# Altium schematic sheet Power.SchDoc
size A4; DocumentNumber: 2; SheetNumber: 2; SheetTotal: 8
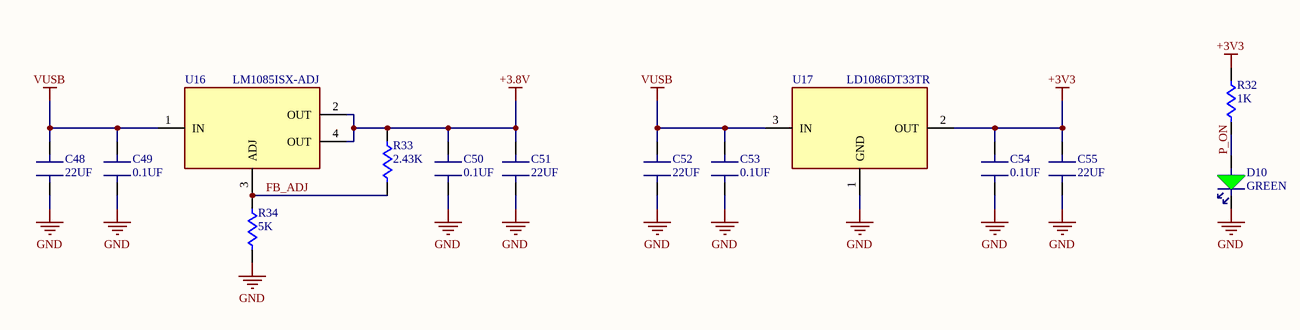
[diagram p0: Power.SchDoc]

## Parts
C48  22UF  [CAP: 1206]
C49  0.1UF  [CAP: 0603]
C50  0.1UF  [CAP: 0603]
C51  22UF  [CAP: 1206]
C52  22UF  [CAP: 1206]
C53  0.1UF  [CAP: 0603]
C54  0.1UF  [CAP: 0603]
C55  22UF  [CAP: 1206]
D10  GREEN  [LED: 0603G]
R32  1K  [RES: 0603]
R33  2.43K  [RES: 0603]
R34  5K  [RES: 0603]
U16  LM1085ISX-ADJ  [TO263-3]
U17  LD1086DT33TR  [DPAK]

## Nets
+3.8V: C50.1(A) C51.2(B) R33.2 U16.2(OUT) U16.4(OUT)
+3V3: C54.1(A) C55.2(B) R32.2 U17.2(OUT)
GND: C48.1(A) C49.2(B) C50.2(B) C51.1(A) C52.1(A) C53.2(B) C54.2(B) C55.1(A) D10.1(C) R34.2 U17.1(GND)
VUSB: C48.2(B) C49.1(A) C52.2(B) C53.1(A) U16.1(IN) U17.3(IN)
FB_ADJ: R33.1 R34.1 U16.3(ADJ)
P_ON: D10.2(A) R32.1

## Notes on the sheet
- Size:
- Date:
- Sheet Name:
- A4
- Sheet
- Time:
- of
- Author :
- Hatim Saad
- Project:
- File:

## Library data of the parts
C48 C51 C52 C55 = CAP 1206: CAP SMD 1206
C49 C50 C53 C54 = CAP 0603: CAP SMD 0603
D10 = LED GREEN 0603: LED GREEN CLEAR 0603 SMD
R32-R34 = RES 0603: RES SMD 0603
U16 = LM1085ISX-ADJ/NOPB: 3-A, 29-V, linear voltage regulator 3-DDPAK/TO-263 -40 to 125; Manufacturer: TI National Semiconductor; Supplier: Mouser; Supplier Part Number: 926-LM1085ISXADJNOPB; Manufacturer Part Number: LM1085ISX-ADJ/NOPB; RoHS: Yes; Category: Voltage Regulators - Linear; Stock: 9505; Pricing: 1=2.08, 10=1.83, 50=1.83, 100=1.47, 1000=1.02, 10000=0.896 (USD); ComponentLink1URL: https://datasheet.ciiva.com/6582/lm1085-6582736.pdf?src-supplier=Digi-Key; ComponentLink1Description: https://datasheet.ciiva.com/6582/lm1085-6582736.pdf?src-supplier=Digi-Key; ComponentLink2URL: https://datasheet.ciiva.com/41457/001013601-da-01-en-ic-reg-l-lm1085isx-adj-nopb-to-263-3-tid-41457358.pdf?src-supplier=Conrad; ComponentLink2Description: https://datasheet.ciiva.com/41457/001013601-da-01-en-ic-reg-l-lm1085isx-adj-nopb-to-263-3-tid-41457358.pdf?src-supplier=Conrad; Supplier 1: Mouser; Supplier Part Number 1: 926-LM1085ISXADJNOPB
U17 = LD1086DT33TR: IC REG LDO 3.3V 1.5A DPAK; Manufacturer: STMicroelectronics; Number of Outputs: 1; Max Supply Voltage: 30V; Dropout Voltage: 1.3V; Polarity: Positive; Quiescent Current: 10mA; Accuracy: 1%; Output Type: Fixed; Min Input Voltage: 6.3V; Input Bias Current: 5mA; Supplier: Mouser; Supplier Part Number: 511-LD1086DT33-TR; Manufacturer Part Number: LD1086DT33TR; RoHS: Yes; Category: Voltage Regulators - Linear; Stock: 228; Pricing: 1=1.61, 10=1.44, 50=1.35, 100=1.13, 1000=0.733, 10000=0.687 (USD); Mounting Technology: Surface Mount; Case/Package: TO-252; Pins: 3; Min Operating Temperature: -40°C; Max Operating Temperature: 125°C; Output Voltage: 3.3V; Packaging: Cut Tape; Max Output current: 1.5A; Output Current: 1.5A; Package Quantity: 1; Series: -; Nominal Output Voltage: 3.3V; Number of Regulators: 1; Min Output Voltage: 3.3V; Length: 6.6mm; Width: 6.2mm; Height: 2.4mm; Radiation Hardening: No; Reach SVHC Compliant: No; Lead Free: Lead Free; RoHS Compliant: Yes; ComponentLink1URL: https://datasheet.ciiva.com/1511/1880971-1511550.pdf?src-supplier=Element14; ComponentLink1Description: https://datasheet.ciiva.com/1511/1880971-1511550.pdf?src-supplier=Element14; ComponentLink2URL: https://datasheet.ciiva.com/1511/1880971-1511549.pdf?src-supplier=Element14; ComponentLink2Description: https://datasheet.ciiva.com/1511/1880971-1511549.pdf?src-supplier=Element14; ComponentLink3URL: https://datasheet.ciiva.com/2043/cd00001884-2043961.pdf?src-supplier=Digi-Key; ComponentLink3Description: https://datasheet.ciiva.com/2043/cd00001884-2043961.pdf?src-supplier=Digi-Key; ComponentLink4URL: https://datasheet.ciiva.com/2043/cd00001884-2043960.pdf?src-supplier=Digi-Key; ComponentLink4Description: https://datasheet.ciiva.com/2043/cd00001884-2043960.pdf?src-supplier=Digi-Key; ComponentLink5URL: https://datasheet.ciiva.com/2043/cd00001884-2043962.pdf?src-supplier=Digi-Key; ComponentLink5Description: https://datasheet.ciiva.com/2043/cd00001884-2043962.pdf?src-supplier=Digi-Key; ComponentLink6URL: https://datasheet.ciiva.com/3225/cd00001884-3225081.pdf?src-supplier=Avnet; ComponentLink6Description: https://datasheet.ciiva.com/3225/cd00001884-3225081.pdf?src-supplier=Avnet; ComponentLink7URL: https://datasheet.ciiva.com/16496/cd00001884-16496030.pdf?src-supplier=Future+Electronics; ComponentLink7Description: https://datasheet.ciiva.com/16496/cd00001884-16496030.pdf?src-supplier=Future+Electronics; Supplier 1: Mouser; Supplier Part Number 1: 511-LD1086DT33-TR